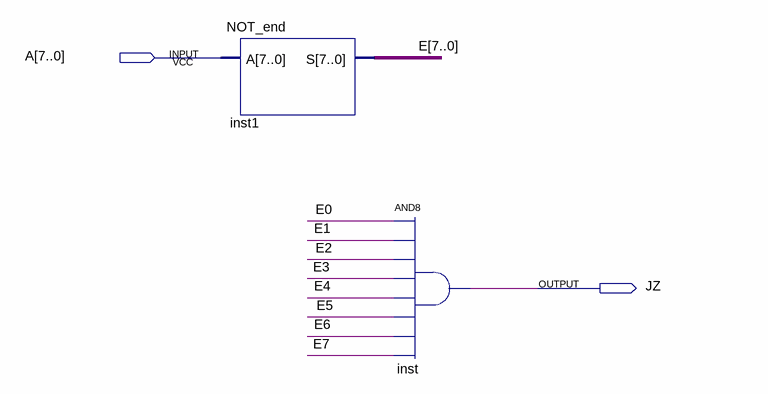
[diagram p0: schematic sheet]
// Quartus schematic JZ.bdf as structural Verilog: 2 symbols, 2 pins
module JZ (
  input  [7:0] A,
  output JZ
);

  wire [7:0] E;

  NOT_end inst1 (.A(A), .S(E));
  and inst (JZ, E[0], E[1], E[2], E[3], E[4], E[5], E[6], E[7]);
endmodule
